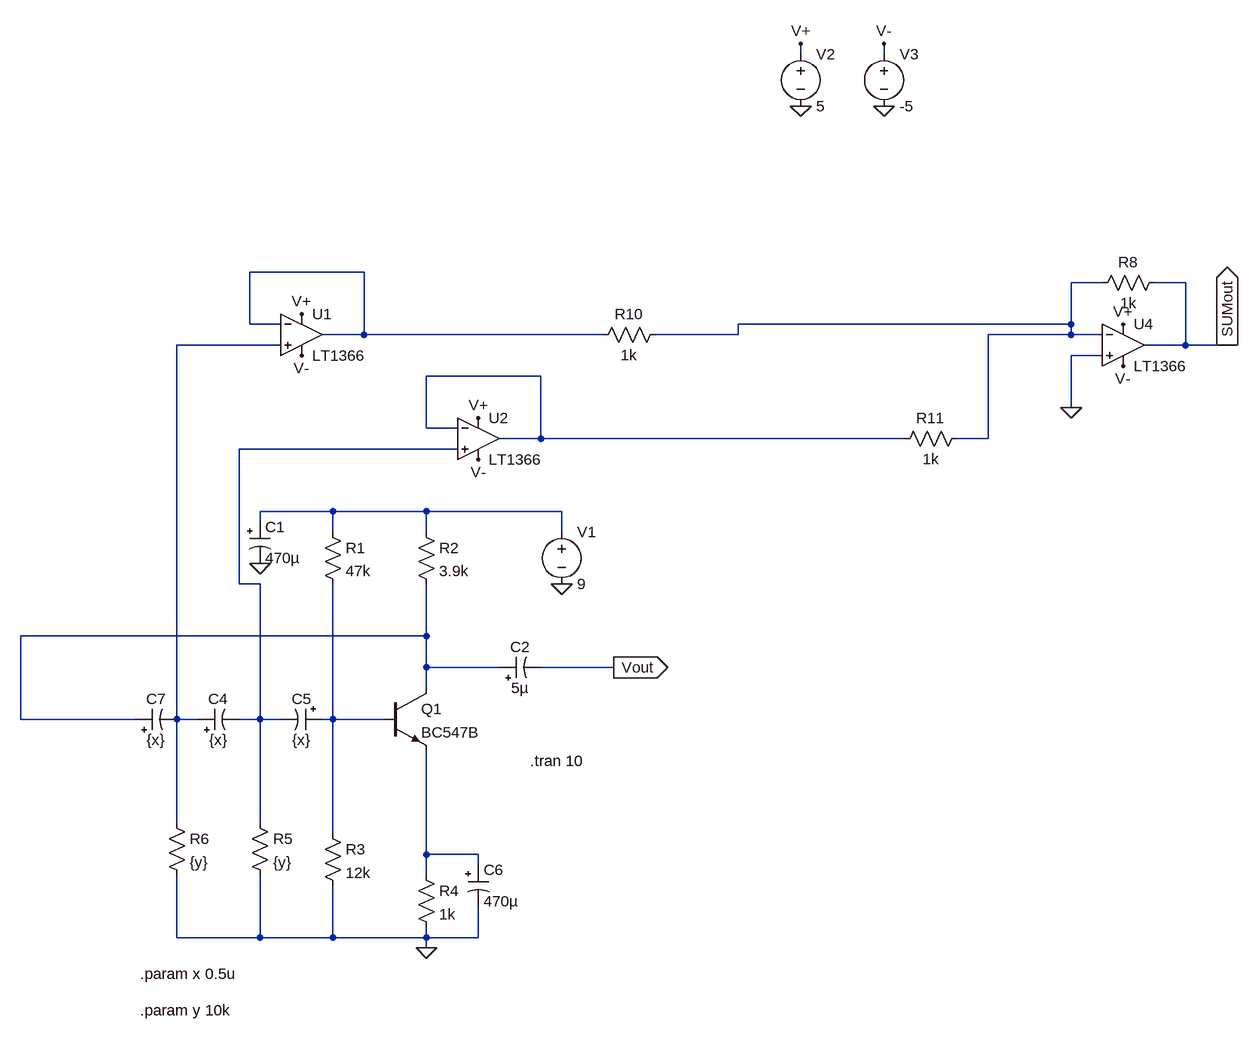
[diagram p0: schematic just_lfo.asc]
just_lfo.asc, the LTspice schematic file:
Version 4
SHEET 1 1752 768
WIRE 1008 -720 1008 -736
WIRE 1136 -720 1136 -736
WIRE 336 -384 160 -384
WIRE 1472 -368 1424 -368
WIRE 1600 -368 1552 -368
WIRE 160 -304 160 -384
WIRE 208 -304 160 -304
WIRE 1424 -304 1424 -368
WIRE 1424 -304 912 -304
WIRE 336 -288 336 -384
WIRE 336 -288 272 -288
WIRE 704 -288 336 -288
WIRE 912 -288 912 -304
WIRE 912 -288 784 -288
WIRE 1424 -288 1424 -304
WIRE 1424 -288 1296 -288
WIRE 1472 -288 1424 -288
WIRE 208 -272 48 -272
WIRE 1600 -272 1600 -368
WIRE 1600 -272 1536 -272
WIRE 1664 -272 1600 -272
WIRE 1680 -272 1664 -272
WIRE 1472 -256 1424 -256
WIRE 608 -224 432 -224
WIRE 1424 -176 1424 -256
WIRE 432 -144 432 -224
WIRE 480 -144 432 -144
WIRE 608 -128 608 -224
WIRE 608 -128 544 -128
WIRE 1168 -128 608 -128
WIRE 1296 -128 1296 -288
WIRE 1296 -128 1248 -128
WIRE 480 -112 144 -112
WIRE 288 -16 176 -16
WIRE 432 -16 288 -16
WIRE 640 -16 432 -16
WIRE 176 0 176 -16
WIRE 288 16 288 -16
WIRE 432 16 432 -16
WIRE 640 16 640 -16
WIRE 144 96 144 -112
WIRE 176 96 144 96
WIRE 432 176 432 96
WIRE 432 176 -192 176
WIRE 432 224 432 176
WIRE 544 224 432 224
WIRE 720 224 608 224
WIRE 432 256 432 224
WIRE -192 304 -192 176
WIRE -16 304 -192 304
WIRE 48 304 48 -272
WIRE 80 304 48 304
WIRE 176 304 176 96
WIRE 176 304 144 304
WIRE 208 304 176 304
WIRE 288 304 288 96
WIRE 288 304 272 304
WIRE 368 304 288 304
WIRE 48 464 48 304
WIRE 176 464 176 304
WIRE 288 480 288 304
WIRE 432 512 432 352
WIRE 512 512 432 512
WIRE 512 528 512 512
WIRE 432 544 432 512
WIRE 48 640 48 544
WIRE 176 640 176 544
WIRE 176 640 48 640
WIRE 288 640 288 560
WIRE 288 640 176 640
WIRE 432 640 432 624
WIRE 432 640 288 640
WIRE 512 640 512 592
WIRE 512 640 432 640
WIRE 432 656 432 640
FLAG 432 656 0
FLAG 720 224 Vout
IOPIN 720 224 Out
FLAG 640 96 0
FLAG 176 64 0
FLAG 1504 -240 V-
FLAG 1504 -304 V+
FLAG 1424 -176 0
FLAG 1136 -640 0
FLAG 1008 -640 0
FLAG 1008 -736 V+
FLAG 1136 -736 V-
FLAG 1664 -272 SUMout
IOPIN 1664 -272 Out
FLAG 240 -256 V-
FLAG 240 -320 V+
FLAG 512 -96 V-
FLAG 512 -160 V+
SYMBOL res 272 0 R0
SYMATTR InstName R1
SYMATTR Value 47k
SYMBOL res 416 0 R0
SYMATTR InstName R2
SYMATTR Value 3.9k
SYMBOL npn 368 256 R0
SYMATTR InstName Q1
SYMATTR Value BC547B
SYMBOL res 272 464 R0
SYMATTR InstName R3
SYMATTR Value 12k
SYMBOL res 416 528 R0
SYMATTR InstName R4
SYMATTR Value 1k
SYMBOL voltage 640 0 R0
SYMATTR InstName V1
SYMATTR Value 9
SYMBOL res 160 448 R0
SYMATTR InstName R5
SYMATTR Value {y}
SYMBOL res 32 448 R0
SYMATTR InstName R6
SYMATTR Value {y}
SYMBOL polcap 160 0 R0
SYMATTR InstName C1
SYMATTR Value 470µ
SYMBOL polcap 544 240 R270
WINDOW 0 32 32 VTop 2
WINDOW 3 0 32 VBottom 2
SYMATTR InstName C2
SYMATTR Value 5µ
SYMBOL polcap 80 320 R270
WINDOW 0 32 32 VTop 2
WINDOW 3 0 32 VBottom 2
SYMATTR InstName C4
SYMATTR Value {x}
SYMBOL polcap 272 288 R90
WINDOW 0 0 32 VBottom 2
WINDOW 3 32 32 VTop 2
SYMATTR InstName C5
SYMATTR Value {x}
SYMBOL polcap 496 528 R0
SYMATTR InstName C6
SYMATTR Value 470µ
SYMBOL polcap -16 320 R270
WINDOW 0 32 32 VTop 2
WINDOW 3 0 32 VBottom 2
SYMATTR InstName C7
SYMATTR Value {x}
SYMBOL LT1366 1504 -336 R0
SYMATTR InstName U4
SYMBOL res 1568 -384 R90
WINDOW 0 0 56 VBottom 2
WINDOW 3 32 56 VTop 2
SYMATTR InstName R8
SYMATTR Value 1k
SYMBOL res 800 -304 R90
WINDOW 0 0 56 VBottom 2
WINDOW 3 32 56 VTop 2
SYMATTR InstName R10
SYMATTR Value 1k
SYMBOL res 1264 -144 R90
WINDOW 0 0 56 VBottom 2
WINDOW 3 32 56 VTop 2
SYMATTR InstName R11
SYMATTR Value 1k
SYMBOL voltage 1008 -736 R0
SYMATTR InstName V2
SYMATTR Value 5
SYMBOL voltage 1136 -736 R0
SYMATTR InstName V3
SYMATTR Value -5
SYMBOL LT1366 240 -352 R0
SYMATTR InstName U1
SYMBOL LT1366 512 -192 R0
SYMATTR InstName U2
TEXT 592 368 Left 2 !.tran 10
TEXT -8 696 Left 2 !.param x 0.5u
TEXT -8 752 Left 2 !.param y 10k

The netlist it stands for:
* just_lfo.asc
R1 N006 N008 47k
R2 N006 N007 3.9k
Q1 N007 N008 N009 0 BC547B
R3 N008 0 12k
R4 N009 0 1k
V1 N006 0 9
R5 N005 0 {y}
R6 N003 0 {y}
C1 N006 0 470µ
C2 N007 Vout 5µ
C4 N003 N005 {x}
C5 N008 N005 {x}
C6 N009 0 470µ
C7 N007 N003 {x}
XU4 0 N002 V+ V- SUMout LT1366  ; pins In+ In- V+ V- OUT
R8 SUMout N002 1k
R10 N002 N001 1k
R11 N002 N004 1k
V2 V+ 0 5
V3 V- 0 -5
XU1 N003 N001 V+ V- N001 LT1366  ; pins In+ In- V+ V- OUT
XU2 N005 N004 V+ V- N004 LT1366  ; pins In+ In- V+ V- OUT
.model NPN NPN
.model PNP PNP
.lib standard.bjt
.tran 10
.param x 0.5u
.param y 10k
.lib LTC.lib
.backanno
.end